# EAGLE design display-board (EAGLE 7.5.0)
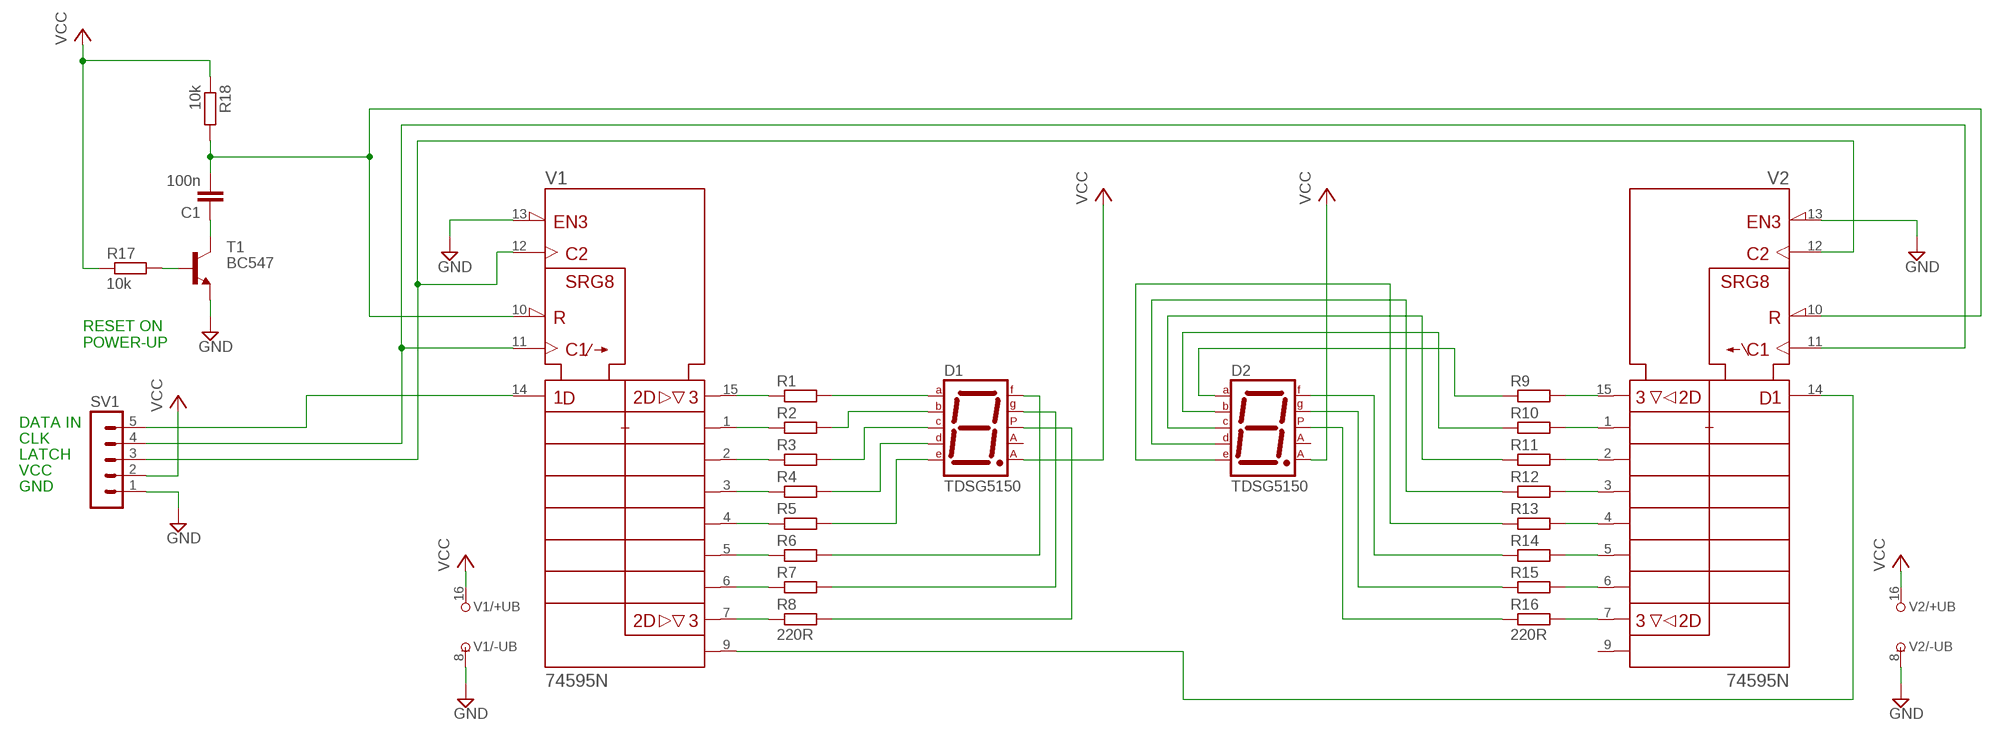
[diagram p0: schematic, sheet 1]

## Parts
C1  100n  C-EU050-024X044  [C050-024X044]
D1  TDSG5150  7SEG-CA  [7SEG-13]
D2  TDSG5150  7SEG-CA  [7SEG-13]
R1  R-EU_0207/7  [0207/7]
R2  R-EU_0207/7  [0207/7]
R3  R-EU_0207/7  [0207/7]
R4  R-EU_0207/7  [0207/7]
R5  R-EU_0207/7  [0207/7]
R6  R-EU_0207/7  [0207/7]
R7  R-EU_0207/7  [0207/7]
R8  220R  R-EU_0207/7  [0207/7]
R9  R-EU_0207/7  [0207/7]
R10  R-EU_0207/7  [0207/7]
R11  R-EU_0207/7  [0207/7]
R12  R-EU_0207/7  [0207/7]
R13  R-EU_0207/7  [0207/7]
R14  R-EU_0207/7  [0207/7]
R15  R-EU_0207/7  [0207/7]
R16  220R  R-EU_0207/7  [0207/7]
R17  10k  R-EU_0207/7  [0207/7]
R18  10k  R-EU_0207/7  [0207/7]
SV1  MA05-1  [MA05-1]
T1  BC547  [TO92]
V1  74595N  [DIL16]
V2  74595N  [DIL16]

## Nets
N$1: D1.7(A) R1.2
N$2: D1.6(B) R2.2
N$3: D1.4(C) R3.2
N$4: D1.2(D) R4.2
N$5: D1.1(E) R5.2
N$6: D1.9(F) R6.2
N$7: D1.10(G) R7.2
N$8: D1.5(DP) R8.2
N$9: D2.7(A) R9.1
N$10: D2.6(B) R10.1
N$11: D2.4(C) R11.1
N$12: D2.2(D) R12.1
N$13: D2.1(E) R13.1
N$14: D2.9(F) R14.1
N$15: D2.10(G) R15.1
N$16: D2.5(DP) R16.1
N$17: R1.1 V1.15(QA)
N$18: R2.1 V1.1(QB)
N$19: R3.1 V1.2(QC)
N$20: R4.1 V1.3(QD)
N$21: R5.1 V1.4(QE)
N$22: R6.1 V1.5(QF)
N$23: R7.1 V1.6(QG)
N$24: R8.1 V1.7(QH)
N$25: R9.2 V2.15(QA)
N$26: R10.2 V2.1(QB)
N$27: R11.2 V2.2(QC)
N$28: R12.2 V2.3(QD)
N$29: R13.2 V2.4(QE)
N$30: R14.2 V2.5(QF)
N$31: R15.2 V2.6(QG)
N$32: R16.2 V2.7(QH)
N$33: V1.9(QH*) V2.14(SER)
N$34: C1.2 R18.2 V1.10(!SRCLR) V2.10(!SRCLR)
N$35: SV1.3 V1.12(RCK) V2.12(RCK)
N$36: SV1.4 V1.11(SRCK) V2.11(SRCK)
N$37: R17.2 T1.2(B)
N$38: SV1.5 V1.14(SER)
N$46: SV1.1 T1.1(E) V1.8(-UB) V1.13(!G) V2.8(-UB) V2.13(!G) ; supply symbol labelled GND
N$61: C1.1 T1.3(C)
VCC: D1.8(CA2) D2.8(CA2) R17.1 R18.1 SV1.2 V1.16(+UB) V2.16(+UB)
Unconnected: D1.3(CA1) D2.3(CA1) V2.9(QH*)

## Notes on the sheet
- RESET ON
  POWER-UP
- DATA IN
- CLK
- LATCH
- VCC
- GND

## Library data of the parts
C1 = rcl:C-EU: CAPACITOR, European symbol
D1 D2 = special:7SEG-CA: 7-segment DISPLAY single anode, 13 mm
R1-R18 = resistor:R-EU_: RESISTOR, European symbol
SV1 = con-lstb:MA05-1: PIN HEADER; OC_FARNELL: unknown; OC_NEWARK: unknown
T1 = transistor:BC547: NPN TRANSISTOR
V1 V2 = 74ttl-din:74*595: 8-bit SHIFT REGISTER, output latch

## Board
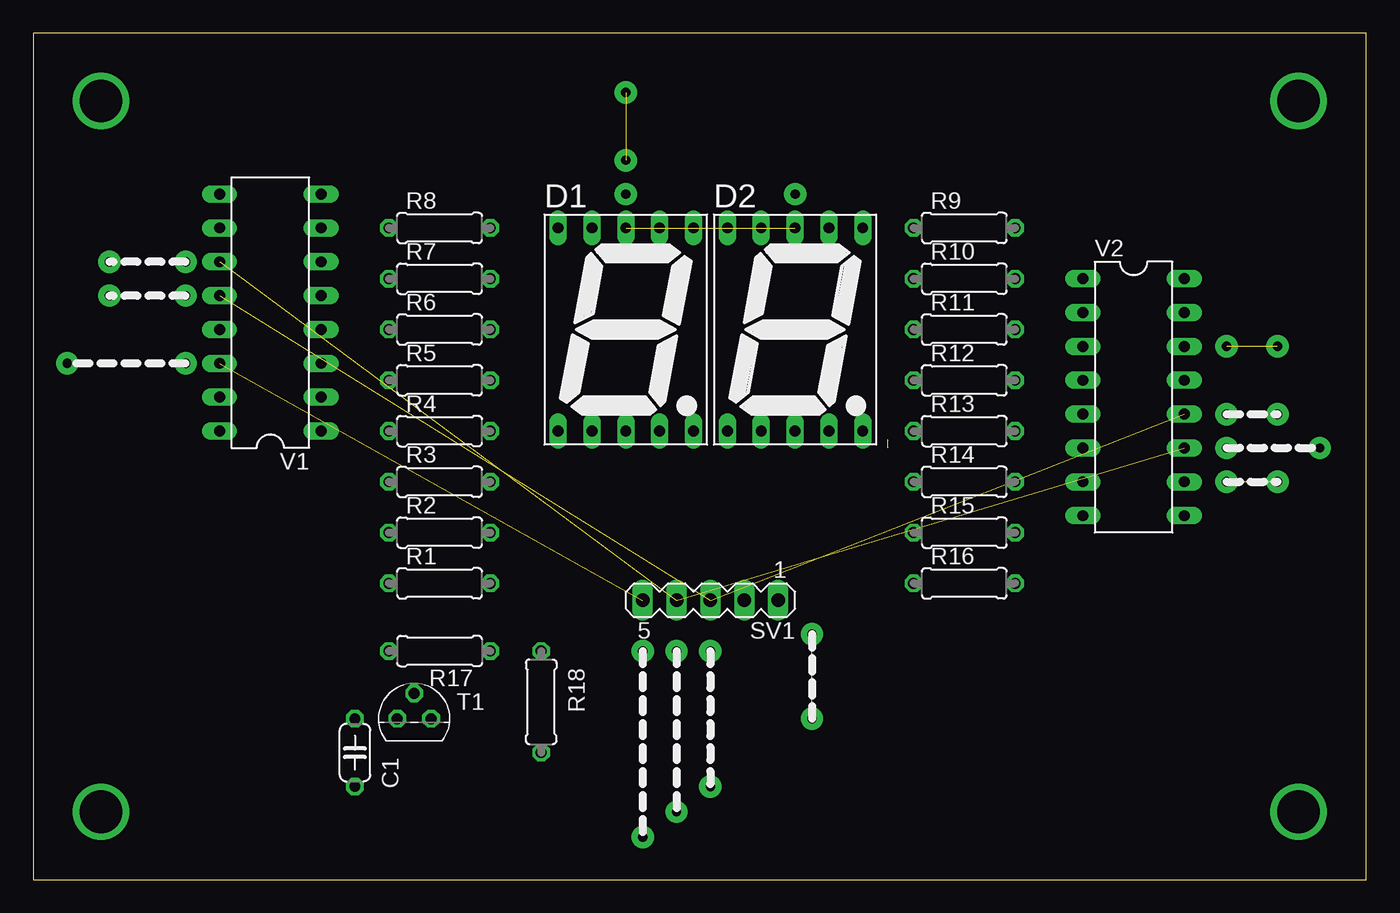
[diagram p1: board, top side]
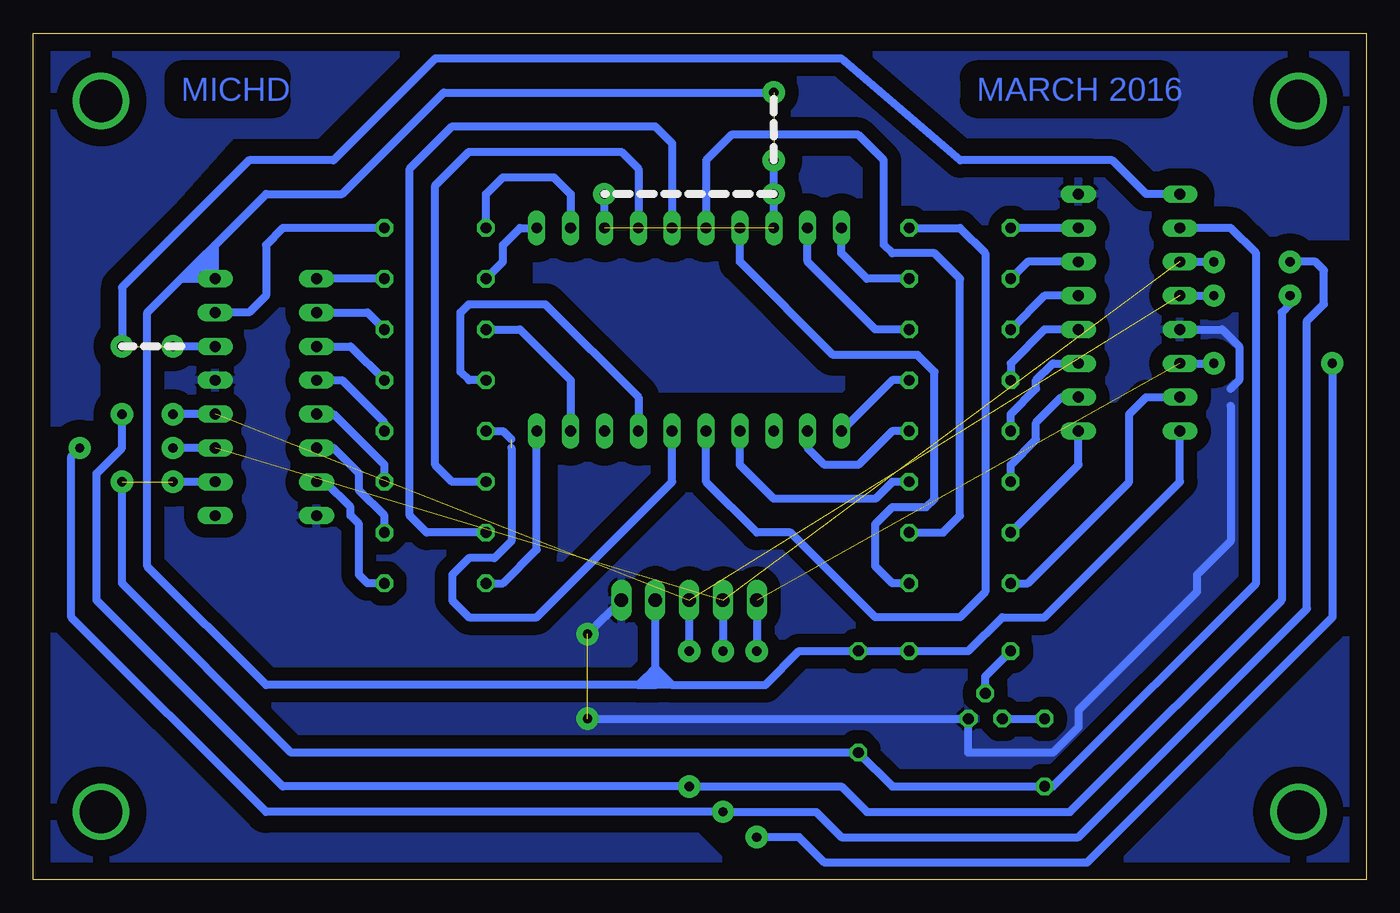
[diagram p2: board, bottom side, seen from below]

Size 100 x 63.5 mm. Coordinates in mm from the lower left corner, seen from the top.
Outline: 0,0 100,0 100,63.5 0,63.5 0,0
Copper layers (1*16): Top 0.035mm / dielectric 1.5mm / Bottom 0.035mm
Design rules "default": minimum track width 10mil, minimum drill 24mil, track to track 8mil, track to pad 8mil, pad to pad 8mil, via to via 8mil, smd to smd 8mil, copper to edge 40mil, drill to drill 8mil, minimum pad ring 10mil, minimum via ring 8mil, stop-mask expansion 4mil, vias tented up to drill 0mil, thermal gap 10mil

### Footprints (pad centres in the part's own frame; a part is rotated, then mirrored left to right if it is on the bottom)
C050-024X044 = drill 0.813 octagon: 1 -2.54,0; 2 2.54,0
7SEG-13 = drill 0.813 long: 1 -5.08,-7.62; 2 -2.54,-7.62; 3 0,-7.62; 4 2.54,-7.62; 5 5.08,-7.62; 6 5.08,7.62; 7 2.54,7.62; 8 0,7.62; 9 -2.54,7.62; 10 -5.08,7.62
0207/7 = drill 0.813 octagon: 1 -3.81,0; 2 3.81,0
MA05-1 = drill 1.016 long: 1 -5.08,0; 2 -2.54,0; 3 0,0; 4 2.54,0; 5 5.08,0
TO92 = drill 0.813 octagon: 1 1.27,0; 2 0,1.905; 3 -1.27,0
DIL16 = drill 0.813 long: 1 -8.89,-3.81; 2 -6.35,-3.81; 3 -3.81,-3.81; 4 -1.27,-3.81; 5 1.27,-3.81; 6 3.81,-3.81; 7 6.35,-3.81; 8 8.89,-3.81; 9 8.89,3.81; 10 6.35,3.81; 11 3.81,3.81; 12 1.27,3.81; 13 -1.27,3.81; 14 -3.81,3.81; 15 -6.35,3.81; 16 -8.89,3.81

### Placement (x,y rotation side)
C1  24.13,9.53 270 top
D1  44.45,41.27 0 top
D2  57.15,41.27 0 top
R1  30.48,22.23 0 top
R2  30.48,26.04 0 top
R3  30.48,29.84 0 top
R4  30.48,33.66 0 top
R5  30.48,37.47 0 top
R6  30.48,41.27 0 top
R7  30.48,45.09 0 top
R8  30.48,48.9 0 top
R9  69.85,48.9 0 top
R10  69.85,45.09 0 top
R11  69.85,41.27 0 top
R12  69.85,37.47 0 top
R13  69.85,33.66 0 top
R14  69.85,29.84 0 top
R15  69.85,26.04 0 top
R16  69.85,22.23 0 top
R17  30.48,17.14 180 top
R18  38.1,13.34 270 top
SV1  50.8,20.95 180 top
T1  28.57,12.06 0 top
V1  17.78,42.55 90 top
V2  82.55,36.2 270 top

### Tracks (layer width: path | path; a pad name or v marks a point on that pad's centre or on a via)
N$1
  Bottom 0.61: D1.7 46.99,46.35 40.01,39.37 33.66,39.37 32.38,38.1 32.38,28.57 33.02,27.94 35.56,27.94 36.83,26.67 36.83,23.5 35.56,22.23 R1.2
N$2
  Bottom 0.61: R2.2 31.75,26.04 30.48,27.3 30.48,45.09 32.38,46.99 35.56,46.99 36.2,47.62 36.2,53.98 38.1,55.88 47.62,55.88 49.53,53.98 D1.6
N$3
  Bottom 0.61: R3.2 35.56,29.84 36.83,28.57 44.45,28.57 46.99,31.11 D1.4
N$4
  Bottom 0.61: R4.2 35.56,33.66 38.1,31.11 40.64,31.11 41.91,32.38 D1.2
N$5
  Bottom 0.61: R5.2 35.56,37.47 D1.1
N$6
  Bottom 0.61: R6.2 36.83,41.27 41.91,46.35 D1.9
N$7
  Bottom 0.61: R7.2 37.47,45.09 39.37,46.99 D1.10
N$8
  Bottom 0.61: R8.2 30.48,48.9 28.57,46.99 28.57,21.59 30.48,19.68 36.83,19.68 43.18,26.04 45.72,26.04 49.53,29.84 D1.5
N$9
  Bottom 0.61: R9.1 66.04,51.44 64.77,52.7 60.96,52.7 59.69,51.44 D2.7
N$10
  Bottom 0.61: R10.1 64.77,46.35 64.77,47.62 63.5,48.9 D2.6
N$11
  Bottom 0.61: R11.1 63.5,41.27 59.69,37.47 D2.4
N$12
  Bottom 0.61: R12.1 67.31,37.47 67.94,38.1 67.94,42.55 67.31,43.18 61.59,43.18 54.61,36.2 D2.2
N$13  (1 unrouted)
  Bottom 0.61: 64.14,32.38 64.14,25.4 65.41,24.13 67.31,24.13 68.58,22.86 68.58,20.95 67.31,19.68 62.23,19.68 52.07,29.84 D2.1 | R13.1 64.77,33.66 64.14,33.02
N$14
  Bottom 0.61: R14.1 68.58,29.84 69.85,31.11 69.85,52.07 67.31,54.61 55.88,54.61 54.61,53.34 D2.9
N$15
  Bottom 0.61: R15.1 70.48,26.04 71.75,27.3 71.75,53.34 68.58,56.52 53.34,56.52 52.07,55.24 D2.10
N$16
  Bottom 0.61: R16.1 64.77,22.23 62.23,24.77 D2.5
N$17
  Bottom 0.61: R1.1 25.4,22.23 17.78,29.84 17.78,34.92 16.51,36.2 V1.15
N$18
  Bottom 0.61: R2.1 21.59,31.11 V1.1
N$19
  Bottom 0.61: V1.2 22.86,36.2 24.77,34.29 24.77,33.02 26.67,31.11 R3.1
N$20
  Bottom 0.61: 22.23,38.73 V1.3 23.5,38.73 24.77,37.47 24.77,36.83 26.67,34.92 R4.1
N$21
  Bottom 0.61: V1.4 24.13,41.27 26.67,38.73 R5.1
N$22
  Bottom 0.61: V1.5 24.13,43.81 R6.1
N$23
  Bottom 0.61: V1.6 25.4,46.35 R7.1
N$24
  Bottom 0.61: V1.7 R8.1
N$25
  Bottom 0.61: R9.2 81.28,48.9 82.55,47.62 82.55,43.81 83.82,42.55 V2.15
N$26
  Bottom 0.61: R10.2 V2.1
N$27
  Bottom 0.61: V2.2 74.93,42.55 R11.2
N$28
  Bottom 0.61: V2.3 76.2,40.01 R12.2
N$29
  Bottom 0.61: V2.4 76.83,37.47 73.66,34.29 R13.2
N$30
  Bottom 0.61: V2.5 77.47,34.92 73.66,31.11 R14.2
N$31
  Bottom 0.61: V2.6 77.47,32.38 75.56,30.48 75.56,29.21 73.66,27.3 R15.2
N$32
  Bottom 0.61: R16.2 74.93,22.23 75.56,22.86 75.56,26.67 76.2,27.3 76.2,27.94 78.11,29.84 V2.7
N$33  (via drill 0.7 pad 1.68)  (1 unrouted)
  Bottom 0.61: V1.9 16.51,51.44 19.05,53.98 30.48,53.98 39.37,61.59 69.85,61.59 77.47,53.98 83.82,53.98 93.34,44.45 v93.34,40.01 | V2.14 89.53,40.01
N$34  (1 unrouted)
  Bottom 0.61: V2.10 89.53,29.84 | 93.34,29.84 93.34,22.23 80.64,9.53 R18.2 35.56,6.99 C1.2 23.5,6.99 8.26,22.23 8.26,46.99 10.16,48.9 V1.10
N$35  (2 unrouted)
  Bottom 0.61: V2.12 89.53,34.92 | V1.12 11.43,43.81 | SV1.3 50.8,17.14
N$36  (2 unrouted)
  Bottom 0.61: V2.11 89.53,32.38 | V1.11 11.43,46.35 | SV1.4 48.26,17.14
N$37
  Bottom 0.61: T1.2 28.57,15.24 R17.2
N$38  (1 unrouted)
  Bottom 0.61: V1.14 11.43,38.73 | SV1.5 45.72,17.14
N$39  (via drill 0.7 pad 1.68)
  other vias: 44.45,51.44
N$40  (via drill 0.7 pad 1.68)
  other vias: 57.15,51.44
N$41  (via drill 0.7 pad 1.68)
  other vias: 44.45,53.98
N$42  (via drill 0.7 pad 1.68)
  other vias: 44.45,59.05
N$43  (via drill 0.7 pad 1.68)
  other vias: 89.53,29.84
N$44  (via drill 0.7 pad 1.68)
  other vias: 93.34,29.84
N$45  (via drill 0.7 pad 1.68)
  other vias: 89.53,40.01
N$46  (via drill 0.7 pad 1.68)  (1 unrouted)
  Bottom 0.61: SV1.1 v58.42,18.41 | v58.42,12.06 T1.1 29.84,9.53 23.5,9.53 21.59,11.43 21.59,12.7 12.7,21.59 12.7,22.86 10.16,25.4 10.16,35.56 | V1.13 10.79,41.27 9.53,40.01 9.53,37.47 10.16,36.83
  pour Bottom (isolate 1.016): 0.64,62.87 0.64,0.64 100.97,0.64 100.97,62.87
N$47  (via drill 0.7 pad 1.68)
  other vias: 89.53,34.92
N$48  (via drill 0.7 pad 1.68)
  other vias: 89.53,32.38
N$49  (via drill 0.7 pad 1.68)
  Bottom 0.61: v93.34,34.92 93.34,32.38 95.25,30.48 95.25,20.95 81.28,6.99 v50.8,6.99 39.37,6.99 37.47,5.08 22.23,5.08 6.35,20.95 6.35,42.55 5.71,43.18 v5.71,43.81
N$50  (via drill 3.2 pad 4)
  other vias: 5.08,58.42
N$51  (via drill 0.7 pad 1.68)
  other vias: 45.72,17.14
N$52  (via drill 0.7 pad 1.68)
  other vias: 48.26,17.14
N$53  (via drill 0.7 pad 1.68)
  other vias: 50.8,17.14
N$54  (via drill 3.2 pad 4)
  other vias: 5.08,5.08
N$55  (via drill 0.7 pad 1.68)
  Bottom 0.61: v96.52,32.38 97.16,31.75 97.16,19.68 82.55,5.08 v48.26,5.08 41.27,5.08 39.37,3.17 21.59,3.17 4.45,20.32 4.45,41.91 3.17,43.18 3.17,45.72 3.81,46.35 v5.71,46.35
N$56  (via drill 3.2 pad 4)
  other vias: 94.92,58.42
N$57  (via drill 0.7 pad 1.68)
  other vias: 11.43,38.73
N$58  (via drill 0.7 pad 1.68)
  other vias: 11.43,43.81
N$59  (via drill 0.7 pad 1.68)
  other vias: 11.43,46.35
N$60  (via drill 3.2 pad 4)
  other vias: 94.92,5.08
N$61
  Bottom 0.61: T1.3 C1.1
N$62  (via drill 0.7 pad 1.68)
  Bottom 0.61: v2.54,38.73 2.54,19.68 20.95,1.27 40.64,1.27 42.55,3.17 v45.72,3.17
N$63
  pour Bottom (isolate 1.27): 49.53,46.99 62.23,46.99 62.23,44.45 60.96,44.45 53.34,36.83 39.37,36.83 39.37,38.1 40.64,38.1
N$64
  pour Bottom (isolate 1.27): 38.1,54.61 36.83,53.34 36.83,50.8 43.18,50.8 43.18,54.61
N$65
  pour Bottom (isolate 1.27): 82.55,3.81 50.8,3.81 48.26,1.27 98.73,1.27 98.73,20.32
N$66
  pour Bottom (isolate 1.27): 98.73,34.29 95.25,34.29 95.25,44.45 85.09,55.88 78.74,55.88 72.39,62.23 98.73,62.23
N$67
  pour Bottom (isolate 1.27): 1.27,48.26 7.62,48.26 10.16,50.8 12.7,50.8 12.7,52.07 13.97,53.34 16.51,53.34 20.32,55.88 31.75,55.88 38.1,62.23 1.27,62.23
N$68
  pour Bottom (isolate 1.27): 1.27,19.05 1.27,1.27 19.05,1.27
N$69
  pour Bottom (isolate 1.27): 53.34,31.75 60.96,31.75 60.96,22.86 53.34,30.48
VCC  (2 unrouted)
  Bottom 0.61: D2.8 57.15,51.44 | 86.36,46.35 V2.16 87.63,45.09 | 86.36,46.35 86.36,46.99 | 86.36,46.99 86.36,47.62 | 86.36,47.62 82.55,51.44 76.83,51.44 69.22,59.05 44.45,59.05 | D1.8 44.45,53.98 | 53.34,15.88 SV1.2 53.34,22.23 | 53.98,15.24 54.61,14.61 | 54.61,14.61 82.55,14.61 91.44,23.5 91.44,42.55 88.9,45.09 | 88.9,45.09 88.27,45.09 | 88.27,45.09 87.63,45.09 | 86.36,47.62 87.63,46.35 | 88.27,45.09 87.63,45.09 | 87.63,46.35 87.63,45.09 | 87.63,45.09 86.36,46.35 | 86.36,46.35 87.63,46.35 | 87.63,46.35 88.9,45.09 | 88.9,45.09 88.27,45.09 | 88.27,45.09 86.36,46.99 | 53.34,15.88 52.7,15.24 | 52.7,15.24 52.07,14.61 | 52.07,14.61 53.34,14.61 | 54.61,14.61 53.34,14.61 | 53.34,14.61 53.34,15.88 | 53.34,15.88 53.98,15.24 | 53.98,15.24 53.34,14.61 | 53.34,14.61 52.7,15.24 | 52.07,14.61 45.09,14.61 42.55,17.14 R18.1 R17.1 29.84,17.14 27.3,19.68 24.13,19.68 13.97,29.84 V1.16

### Text on the board
Bottom: MARCH 2016 | MICHD